# EAGLE design Schematic (EAGLE 8.5.0)
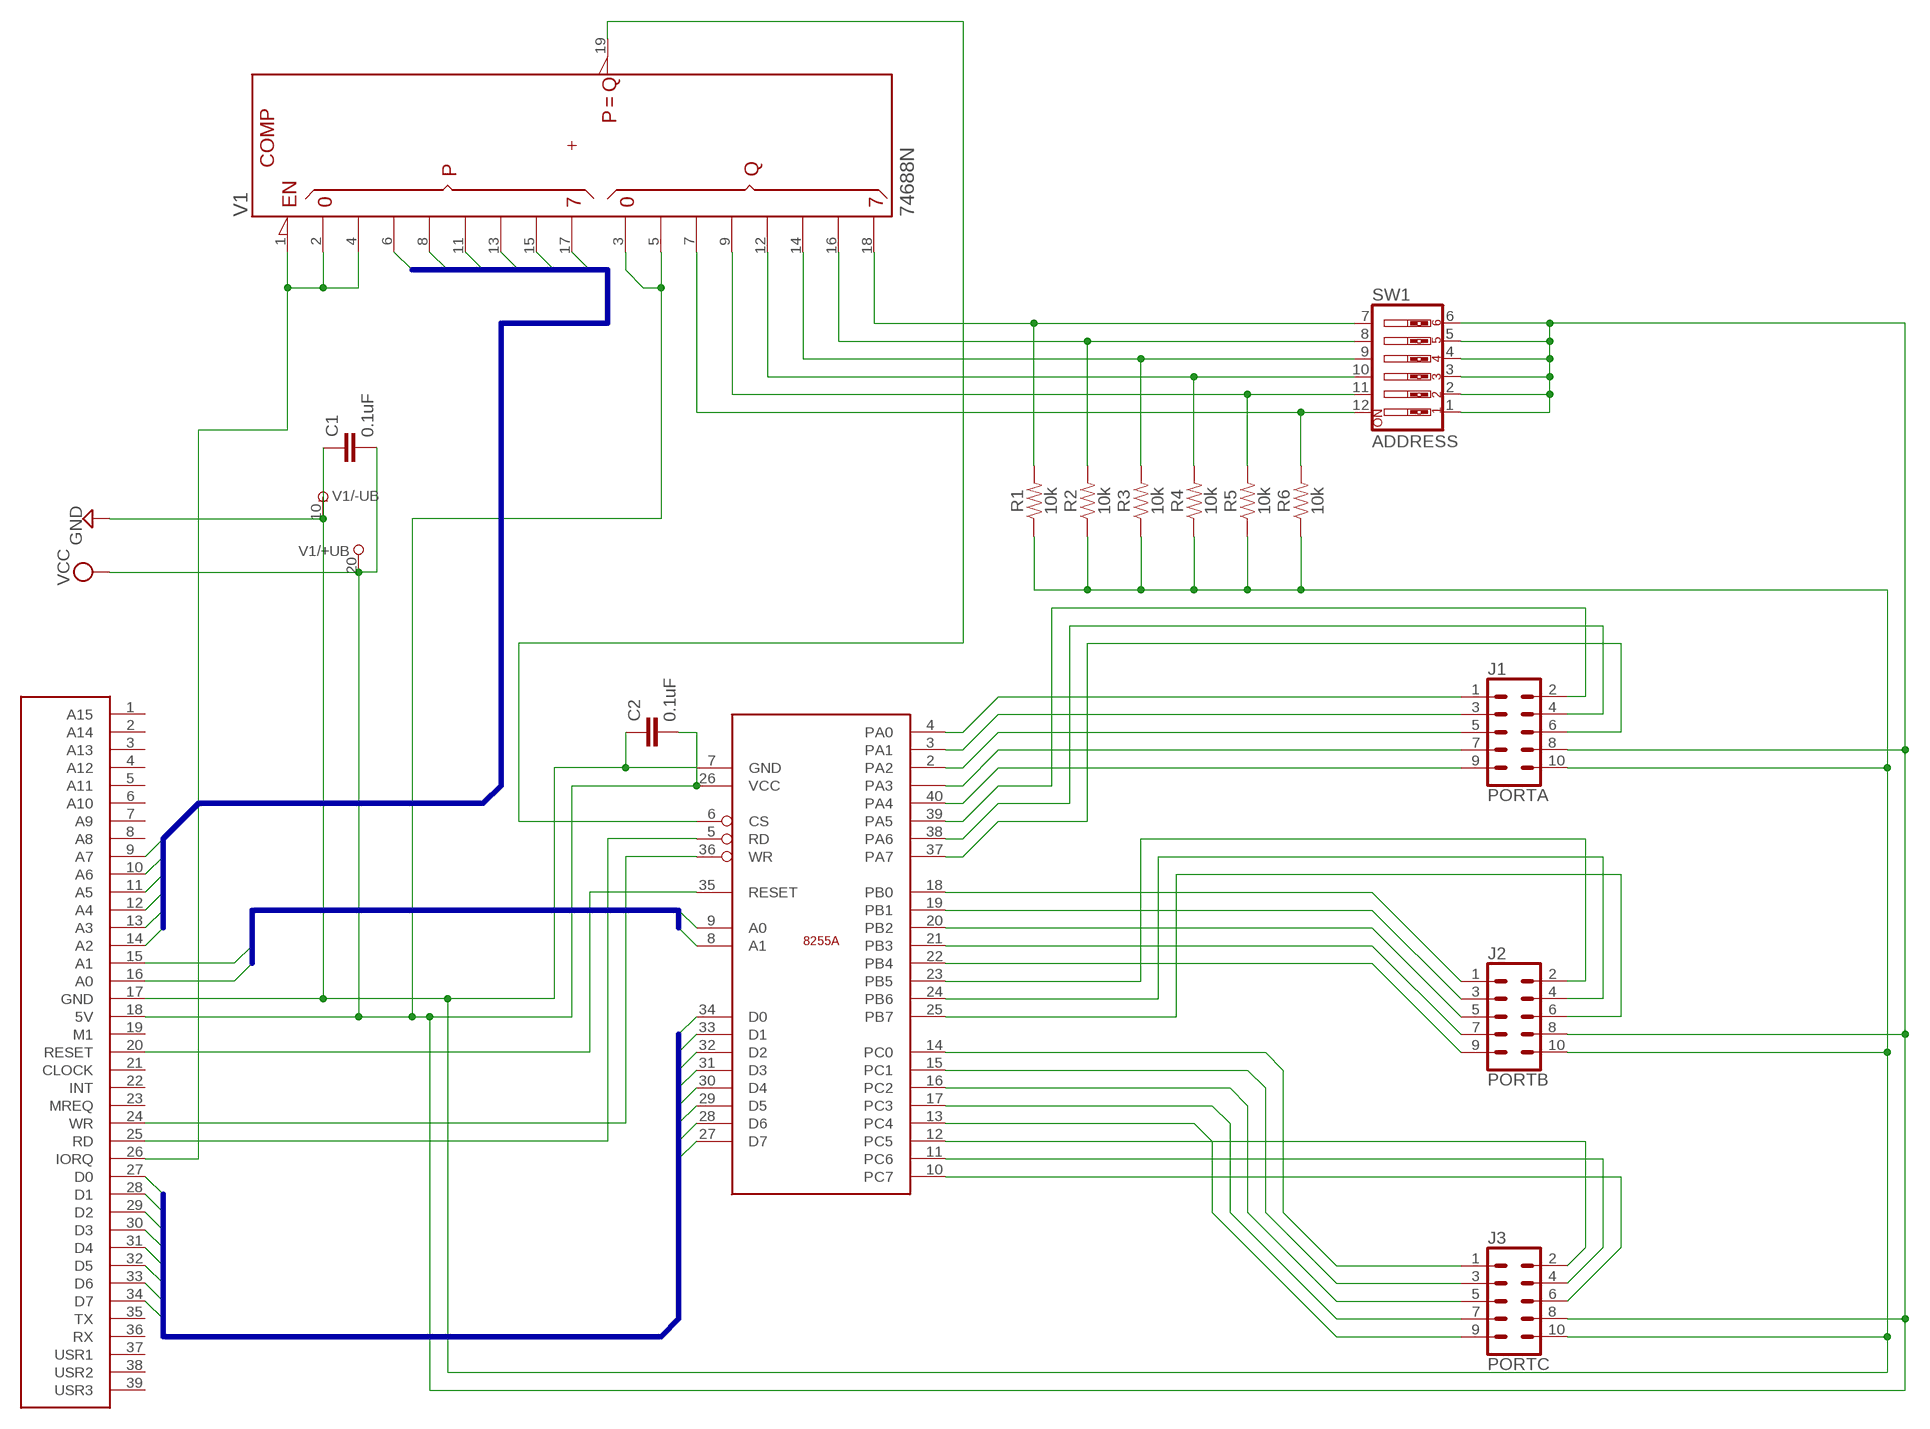
[diagram p0: schematic, sheet 1]

## Parts
C1  0.1uF  0.1UF-KIT-EZ-50V-20%  [CAP-PTH-SMALL-KIT]
C2  0.1uF  0.1UF-KIT-EZ-50V-20%  [CAP-PTH-SMALL-KIT]
J1  PORTA  CONN_05X2SHD  [2X5-SHROUDED]
J2  PORTB  CONN_05X2SHD  [2X5-SHROUDED]
J3  PORTC  CONN_05X2SHD  [2X5-SHROUDED]
R1  10k  10KOHM-HORIZ-1/4W-1%  [AXIAL-0.3]
R2  10k  10KOHM-HORIZ-1/4W-1%  [AXIAL-0.3]
R3  10k  10KOHM-HORIZ-1/4W-1%  [AXIAL-0.3]
R4  10k  10KOHM-HORIZ-1/4W-1%  [AXIAL-0.3]
R5  10k  10KOHM-HORIZ-1/4W-1%  [AXIAL-0.3]
R6  10k  10KOHM-HORIZ-1/4W-1%  [AXIAL-0.3]
SW1  ADDRESS  SW_DIP-6  [EDG-06]
U$1  RC2014BUS  [RC2014BUS]
U$2  8255  [8255]
V1  74688N  [DIL20]

## Nets
ADRBUS0: U$1.14(A2) U$1.15(A1) U$1.16(A0) U$2.9(A0) V1.6(P2)
ADRBUS1: U$1.13(A3) U$2.8(A1) V1.8(P3)
ADRBUS2: U$1.12(A4) V1.11(P4)
ADRBUS3: U$1.11(A5) V1.13(P5)
ADRBUS4: U$1.10(A6) V1.15(P6)
ADRBUS5: U$1.9(A7) V1.17(P7)
DATABUS0: U$1.27(D0) U$2.34(D0)
DATABUS1: U$1.28(D1) U$2.33(D1)
DATABUS2: U$1.29(D2) U$2.32(D2)
DATABUS3: U$1.30(D3) U$2.31(D3)
DATABUS4: U$1.31(D4) U$2.30(D4)
DATABUS5: U$1.32(D5) U$2.29(D5)
DATABUS6: U$1.33(D6) U$2.28(D6)
DATABUS7: U$1.34(D7) U$2.27(D7)
GND: C1.1 C2.1 J1.10 J2.10 J3.10 R1.P$1 R2.P$1 R3.P$1 R4.P$1 R5.P$1 R6.P$1 U$1.17(GND) U$2.7(GND) V1.10(-UB)
N$1: U$1.20(RESET) U$2.35(RESET)
N$4: U$1.25(RD) U$2.5(RD)
N$5: U$1.24(WR) U$2.36(WR)
N$26: U$2.6(CS) V1.19(!P=Q)
N$33: U$1.26(IORQ) V1.1(!G) V1.2(P0) V1.4(P1)
N$34: R1.P$2 SW1.7 V1.18(Q7)
N$35: R2.P$2 SW1.8 V1.16(Q6)
N$36: R3.P$2 SW1.9 V1.14(Q5)
N$37: R4.P$2 SW1.10 V1.12(Q4)
N$38: R5.P$2 SW1.11 V1.9(Q3)
N$39: R6.P$2 SW1.12 V1.7(Q2)
N$40: J2.1 U$2.18(PB0)
N$41: J1.7 U$2.1(PA3)
N$42: J1.9 U$2.40(PA4)
N$43: J1.2 U$2.39(PA5)
N$44: J1.4 U$2.38(PA6)
N$45: J1.6 U$2.37(PA7)
N$46: J1.1 U$2.4(PA0)
N$47: J1.3 U$2.3(PA1)
N$48: J1.5 U$2.2(PA2)
N$49: J2.3 U$2.19(PB1)
N$50: J2.5 U$2.20(PB2)
N$51: J2.7 U$2.21(PB3)
N$52: J2.9 U$2.22(PB4)
N$53: J2.2 U$2.23(PB5)
N$54: J2.4 U$2.24(PB6)
N$55: J2.6 U$2.25(PB7)
N$56: J3.1 U$2.14(PC0)
N$57: J3.3 U$2.15(PC1)
N$58: J3.5 U$2.16(PC2)
N$59: J3.7 U$2.17(PC3)
N$60: J3.9 U$2.13(PC4)
N$61: J3.2 U$2.12(PC5)
N$62: J3.4 U$2.11(PC6)
N$63: J3.6 U$2.10(PC7)
VCC: C1.2 C2.2 J1.8 J2.8 J3.8 SW1.1 SW1.2 SW1.3 SW1.4 SW1.5 SW1.6 U$1.18(5V) U$2.26(VCC) V1.3(Q0) V1.5(Q1) V1.20(+UB)
Unconnected: U$1.1(A15) U$1.2(A14) U$1.3(A13) U$1.4(A12) U$1.5(A11) U$1.6(A10) U$1.7(A9) U$1.8(A8) U$1.19(M1) U$1.21(CLOCK) U$1.22(INT) U$1.23(MREQ) U$1.35(TX) U$1.36(RX) U$1.37(USR1) U$1.38(USR2) U$1.39(USR3)

## Buses
DATABUS[0..7]
ADRBUS[0..1]
ADRBUS[0..5]

## Library data of the parts
C1 C2 = SparkFun-Capacitors:0.1UF: 0.1µF ceramic capacitors A capacitor is a passive two-terminal electrical component used to store electrical energy temporarily in an electric field.; PROD_ID: CAP-08370
J1-J3 = SparkFun-Connectors:CONN_05X2: Multi connection point. Often used as Generic Header-pin footprint for 0.1 inch spaced/style header connections For AVR SPI programming port, see special device with nice symbol: "AVR_SPI_PROG_5x2.dev" You can populate with any combo of single row headers, but if you'd like an exact match, check these: 2x5 AVR ICSP Male Header <https://www.sparkfun.com/products/778> (PRT-00778) 2x5 Pin Shrouded Header <https://www.sparkfun.com/products/8506> (PRT-08506) On any of the 0.1 inch spaced packages, you can populate with these: Break Away Headers - Straight <https://www.sparkfun.com/products/116> (PRT-00116) Break Away Male Headers - Right Angle <https://www.sparkfun.com/products/553> (PRT-00553) Female Headers <https://www.sparkfun.com/products/115> (PRT-00115) Break Away Headers - Machine Pin <https://www.sparkfun.com/products/117> (PRT-00117) Break Away Female Headers - Swiss Machine Pin <https://www.sparkfun.com/products/743> (PRT-00743) Special note: the shrouded connector mates well with our 5x2 ribbon cables: 2x5 Pin IDC Ribbon Cable <https://www.sparkfun.com/products/8535> (PRT-08535); PROD_ID: CONN-08671; SF_ID: PRT-08506
R1-R6 = SparkFun-Resistors:10KOHM: 10kΩ resistor A resistor is a passive two-terminal electrical component that implements electrical resistance as a circuit element. Resistors act to reduce current flow, and, at the same time, act to lower voltage levels within circuits. - Wikipedia; PROD_ID: RES-12183
SW1 = special:SW_DIP-6: DIP SWITCH
U$1 = my_lib:RC2014BUS: RC2014 BUS
U$2 = my_lib:8255: The Intel 8255 (or i8255) Programmable Peripheral Interface (PPI) chip was developed and manufactured by Intel in the first half of the 1970s for the Intel 8080 microprocessor.
V1 = 74ttl-din:74*688: 8-bit MAGNITUDE/IDENTITY COMPARATOR, totem pole

## Board
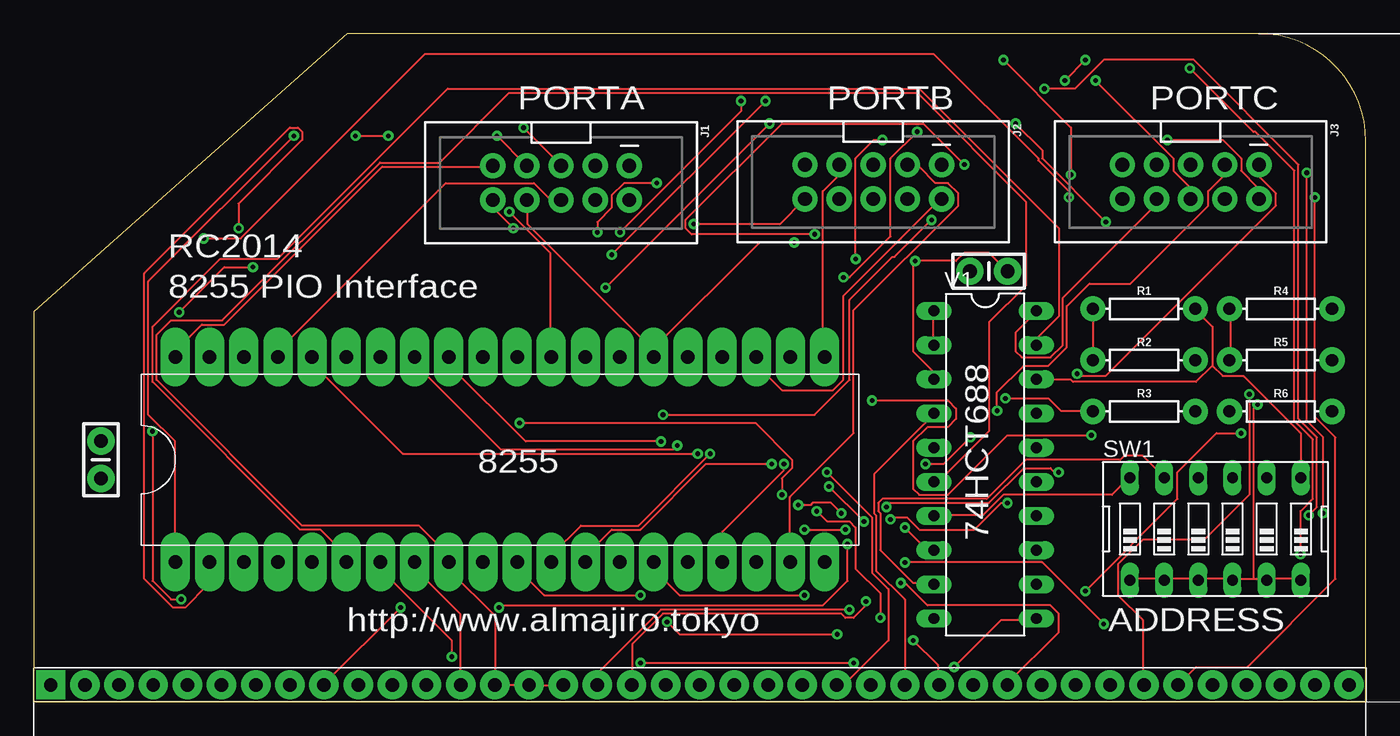
[diagram p1: board, top side]
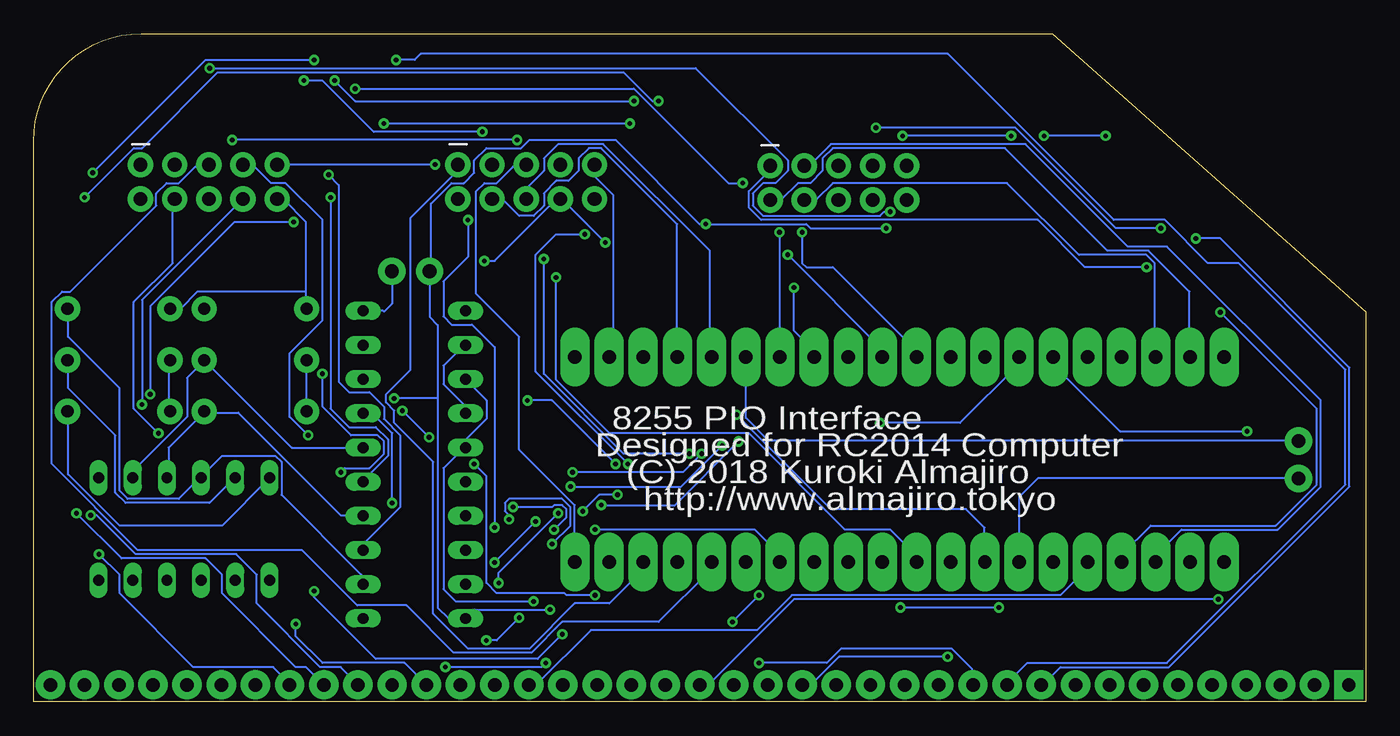
[diagram p2: board, bottom side, seen from below]

Size 99.04 x 49.66 mm. Coordinates in mm from the lower left corner, seen from the top.
Outline: 0,0 99.04,0 99.04,41.67 arc90 91.05,49.66 23.32,49.66 0,29 0,0
Copper layers (1*16): Top 0.035mm / dielectric 1.5mm / Bottom 0.035mm
Design rules "default": minimum track width 6mil, minimum drill 0.35mm, track to track 6mil, track to pad 6mil, pad to pad 6mil, via to via 6mil, smd to smd 6mil, copper to edge 40mil, drill to drill 6mil, minimum pad ring 10mil, minimum via ring 8mil, stop-mask expansion 4mil, vias tented up to drill 0mil, thermal gap 10mil

### Footprints (pad centres in the part's own frame; a part is rotated, then mirrored left to right if it is on the bottom)
CAP-PTH-SMALL-KIT = drill 1.016 pad 2.032: 1 -1.397,0; 2 1.397,0
2X5-SHROUDED = drill 1.016 pad 1.88: 1 -1.27,5.08; 2 1.27,5.08; 3 -1.27,2.54; 4 1.27,2.54; 5 -1.27,0; 6 1.27,0; 7 -1.27,-2.54; 8 1.27,-2.54; 9 -1.27,-5.08; 10 1.27,-5.08
AXIAL-0.3 = drill 0.9 pad 1.88: P$1 -3.81,0; P$2 3.81,0
EDG-06 = drill 0.813 long: 1 -6.35,-3.81; 2 -3.81,-3.81; 3 -1.27,-3.81; 4 1.27,-3.81; 5 3.81,-3.81; 6 6.35,-3.81; 7 6.35,3.81; 8 3.81,3.81; 9 1.27,3.81; 10 -1.27,3.81; 11 -3.81,3.81; 12 -6.35,3.81
RC2014BUS = drill 1 pad 2.184 square: 1 -17.78,22.86 | drill 1 pad 2.184: 2 -17.78,20.32; 3 -17.78,17.78; 4 -17.78,15.24; 5 -17.78,12.7; 6 -17.78,10.16; 7 -17.78,7.62; 8 -17.78,5.08; 9 -17.78,2.54; 10 -17.78,0; 11 -17.78,-2.54; 12 -17.78,-5.08; 13 -17.78,-7.62; 14 -17.78,-10.16; 15 -17.78,-12.7; 16 -17.78,-15.24; 17 -17.78,-17.78; 18 -17.78,-20.32; 19 -17.78,-22.86; 20 -17.78,-25.4; 21 -17.78,-27.94; 22 -17.78,-30.48; 23 -17.78,-33.02; 24 -17.78,-35.56; 25 -17.78,-38.1; 26 -17.78,-40.64; 27 -17.78,-43.18; 28 -17.78,-45.72; 29 -17.78,-48.26; 30 -17.78,-50.8; 31 -17.78,-53.34; 32 -17.78,-55.88; 33 -17.78,-58.42; 34 -17.78,-60.96; 35 -17.78,-63.5; 36 -17.78,-66.04; 37 -17.78,-68.58; 38 -17.78,-71.12; 39 -17.78,-73.66
8255 = drill 1 pad 2.184 long: 1 -7.62,13.97; 2 -7.62,11.43; 3 -7.62,8.89; 4 -7.62,6.35; 5 -7.62,3.81; 6 -7.62,1.27; 7 -7.62,-1.27; 8 -7.62,-3.81; 9 -7.62,-6.35; 10 -7.62,-8.89; 11 -7.62,-11.43; 12 -7.62,-13.97; 13 -7.62,-16.51; 14 -7.62,-19.05; 15 -7.62,-21.59; 16 -7.62,-24.13; 17 -7.62,-26.67; 18 -7.62,-29.21; 19 -7.62,-31.75; 20 -7.62,-34.29; 21 7.62,-34.29; 22 7.62,-31.75; 23 7.62,-29.21; 24 7.62,-26.67; 25 7.62,-24.13; 26 7.62,-21.59; 27 7.62,-19.05; 28 7.62,-16.51; 29 7.62,-13.97; 30 7.62,-11.43; 31 7.62,-8.89; 32 7.62,-6.35; 33 7.62,-3.81; 34 7.62,-1.27; 35 7.62,1.27; 36 7.62,3.81; 37 7.62,6.35; 38 7.62,8.89; 39 7.62,11.43; 40 7.62,13.97
DIL20 = drill 0.813 long: 1 -11.43,-3.81; 2 -8.89,-3.81; 3 -6.35,-3.81; 4 -3.81,-3.81; 5 -1.27,-3.81; 6 1.27,-3.81; 7 3.81,-3.81; 8 6.35,-3.81; 9 8.89,-3.81; 10 11.43,-3.81; 11 11.43,3.81; 12 8.89,3.81; 13 6.35,3.81; 14 3.81,3.81; 15 1.27,3.81; 16 -1.27,3.81; 17 -3.81,3.81; 18 -6.35,3.81; 19 -8.89,3.81; 20 -11.43,3.81

### Placement (x,y rotation side)
C1  71,32 0 top
C2  5,18 90 top
J1  39.21,38.57 270 top
J2  62.42,38.64 270 top
J3  86.01,38.64 270 top
R1  82.55,29.21 0 top
R2  82.55,25.4 0 top
R3  82.55,21.59 0 top
R4  92.71,29.21 0 top
R5  92.71,25.4 0 top
R6  92.71,21.59 0 top
SW1  87.86,12.85 0 top
U$1  24.13,19.05 90 top
U$2  24.51,18.01 90 top
V1  70.74,17.63 270 top

### Tracks (layer width: path | path; a pad name or v marks a point on that pad's centre or on a via)
ADRBUS0
  Top 0.152: U$1.16 39.32,1.22 36.88,1.22 U$1.15 36.73,1.22 34.29,1.22 U$1.14 34.29,6.4 30.94,9.75 30.94,10.36 U$2.9 30.79,10.52 30.79,10.97 28.65,13.11 19.96,13.11 9.14,23.93 9.14,27.28 10.21,28.35 14.02,28.35 25.76,40.08 30.18,40.08 35.36,45.26 65.68,45.26 73.76,37.19 73.76,30.94 71.02,28.19 71.02,20.12 67.36,16.46 67.06,16.46 V1.6
ADRBUS1  (via drill 0.35)
  Top 0.152: V1.8 66.45,11.28 v64.77,12.95 | v66.75,35.81 64.01,33.07 63.86,33.07 60.66,29.87 60.66,23.93 58.06,21.34 v46.79,21.34 | U$1.13 31.7,1.37 31.7,6.55 28.35,9.91 28.35,10.36 U$2.8
  Bottom 0.152: v64.77,12.95 64.77,26.36 66.45,28.04 67.97,28.04 68.58,28.65 68.58,31.24 66.75,33.07 v66.75,35.81 | v46.79,21.34 39.78,14.33 29.72,14.33 28.35,12.95 28.35,10.52 U$2.8
ADRBUS2  (via drill 0.35)
  Top 0.152: v68.43,2.59 71.93,6.1 74.52,6.1 V1.11 | v45.11,2.9 v60.96,2.9
  Bottom 0.152: v68.43,2.59 61.27,2.59 v60.96,2.9 | v45.11,2.9 40.08,2.9 39.01,3.96 30.79,3.96 29.26,2.44 29.26,1.37 U$1.12
ADRBUS3  (via drill 0.35)
  Top 0.152: v77.11,39.17 77.11,42.67 v72.08,47.7
  Bottom 0.152: v77.11,39.17 76.35,38.41 76.35,23.77 75.59,23.01 74.07,23.01 73,21.95 73,21.03 71.78,19.81 71.78,14.48 74.52,11.73 74.52,11.28 V1.13 | v72.08,47.7 70.71,47.7 70.26,48.16 31.09,48.16 18.75,35.81 14.94,35.81 11.73,32.61 9.45,32.61 1.52,24.69 1.52,16.15 14.78,2.9 25.15,2.9 26.67,1.37 U$1.11
ADRBUS4  (via drill 0.35)
  Top 0.152: v76.96,37.49 76.96,37.95 74.68,40.23 74.68,40.39 66.9,48.16 29.11,48.16 15.39,34.44 v12.65,34.44
  Bottom 0.152: v76.96,37.49 76.96,21.79 75.59,20.42 73.61,20.42 72.69,19.51 72.69,18.29 74.52,16.46 V1.15 | v12.65,34.44 10.82,34.44 1.22,24.84 1.22,16 14.63,2.59 22.71,2.59 24.08,1.22 U$1.10
ADRBUS5  (via drill 0.35)
  Top 0.152: v72.39,14.78 71.93,14.78 69.95,12.8 65.84,12.8 64.92,13.72 63.86,13.72 v63.7,13.56 | v60.5,11.73 60.5,8.99 58.67,7.16 34.75,7.16 v34.59,7.01 | v27.28,7.01 21.64,1.37 U$1.9
  Bottom 0.152: v72.39,14.78 72.39,19.96 73.76,21.34 74.52,21.34 V1.17 | v63.7,13.56 63.7,13.87 64.01,14.17 64.01,14.78 63.7,15.09 59.74,15.09 59.13,14.48 59.13,13.11 v60.5,11.73 | v27.28,7.01 v34.59,7.01
DATABUS0  (via drill 0.35)
  Top 0.152: v65.38,4.57 67.21,2.74 67.21,1.37 U$1.27 | v62.94,6.25 62.94,8.08 61.11,9.91 61.11,12.95 60.66,13.41 58.98,13.41 v58.22,14.17 | v55.63,15.39 55.63,16.61 56.39,17.37 56.39,17.98 53.65,20.73 v36.12,20.73
  Bottom 0.152: v65.38,4.57 64.62,4.57 v62.94,6.25 | v58.22,14.17 57,15.39 v55.63,15.39 | v36.12,20.73 30.18,20.73 25.91,24.99 25.91,25.6 U$2.34
DATABUS1  (via drill 0.35)
  Top 0.152: v47.85,19.05 47.55,18.75 34.75,18.75 28.35,25.15 28.35,25.6 U$2.33 | v61.72,13.41 v59.13,16 | v64.77,10.36 74.98,10.36 v79.55,5.79
  Bottom 0.152: v47.85,19.05 50.9,16 v59.13,16 | v64.77,10.36 v61.72,13.41 | v79.55,5.79 79.55,4.88 77.57,2.9 71.48,2.9 U$1.28
DATABUS2  (via drill 0.35)
  Top 0.152: v46.63,19.36 36.58,19.36 30.94,24.99 30.94,25.6 U$2.32 | v56.84,14.63 57.76,14.63 57.91,14.78 59.28,14.78 v60.05,14.02 | v64.47,8.84 64.77,8.84 66.45,7.16 75.59,7.16 76.2,6.55 76.2,5.18 72.39,1.37 U$1.29
  Bottom 0.152: v46.63,19.36 51.36,14.63 v56.84,14.63 | v60.05,14.02 64.47,9.6 v64.47,8.84
DATABUS3  (via drill 0.35)
  Top 0.152: v41.91,34.9 41.91,35.66 42.98,36.73 42.98,37.64 43.89,38.56 v46.33,38.56 | v75.13,45.57 77.42,45.57 79.55,47.7 86.26,47.7 94.03,39.93 94.03,21.03 95.4,19.66 95.4,14.48 v94.79,13.87
  Bottom 0.152: v41.91,34.9 41.91,32.61 41.6,32.31 39.62,32.31 33.53,26.21 33.53,25.76 U$2.31 | v46.33,38.56 47.4,38.56 54.41,45.57 v75.13,45.57 | v94.79,13.87 94.34,13.87 91.44,10.97 83.97,10.97 82.45,9.45 82.45,7.32 77.72,2.59 76.2,2.59 74.98,1.37 U$1.30
DATABUS4  (via drill 0.35)
  Top 0.152: v54.41,44.65 v42.98,33.22 | v78.18,47.7 v76.66,46.18 | v94.64,39.32 94.64,20.88 95.86,19.66 v95.86,14.02
  Bottom 0.152: v42.98,33.22 35.97,26.21 35.97,25.76 U$2.30 | v54.41,44.65 75.13,44.65 v76.66,46.18 | v78.18,47.7 86.26,47.7 v94.64,39.32 | v95.86,14.02 92.51,10.67 86.26,10.67 85.04,9.45 85.04,8.08 79.55,2.59 78.79,2.59 U$1.31
DATABUS5  (via drill 0.35)
  Top 0.152: v35.36,36.42 38.41,33.38 38.41,25.76 U$2.29 | v85.95,47.09 90.68,42.37 90.83,42.37 93.73,39.47 93.73,20.88 95.1,19.51 95.1,15.09 94.18,14.17 v94.18,10.97
  Bottom 0.152: v35.36,36.42 35.81,36.42 36.12,36.12 44.81,36.12 45.57,36.88 45.57,37.8 44.81,38.56 43.89,38.56 42.98,39.47 42.98,40.23 49.84,47.09 v85.95,47.09 | v94.18,10.97 92.66,9.45 92.66,8.08 87.17,2.59 81.23,2.59 80.01,1.37 U$1.32
DATABUS6  (via drill 0.35)
  Top 0.152: v90.37,22.86 90.37,15.39 87.02,12.04 82.45,12.04 80.62,10.21 80.62,7.92 82.45,6.1 82.45,1.37 U$1.33 | v79.7,35.66 74.98,40.39 74.98,41 v73,42.98 | v42.52,30.79 v54.71,42.98
  Bottom 0.152: v90.37,22.86 90.37,29.41 84.12,35.66 v79.7,35.66 | v54.71,42.98 v73,42.98 | v42.52,30.79 42.52,27.58 41.15,26.21 41.15,25.76 U$2.28
DATABUS7  (via drill 0.35)
  Top 0.152: v43.59,34.9 52.58,43.89 v52.58,44.65 | v95.25,37.49 95.25,21.18 96.77,19.66 96.77,9.14 90.22,2.59 86.41,2.59 U$1.34
  Bottom 0.152: v43.59,34.9 43.59,25.76 U$2.27 | v52.58,44.65 53.03,44.65 55.17,46.79 85.34,46.79 90.98,41.15 91.59,41.15 v95.25,37.49
GND  (via drill 0.35)
  Top 0.152: R4.P$1 89,29.11 89,25.45 R5.P$1 | R1.P$1 78.79,29.11 78.79,25.45 R2.P$1 | v35.66,35.2 34.14,36.73 34.14,37.19 J1.10 | v49.07,35.51 55.47,35.51 57.3,37.34 J2.10 | v31.09,3.35 31.09,4.57 25.91,9.75 25.91,10.36 U$2.7 | U$1.17 41.91,2.13 46.63,6.86 v60.66,6.86 | v72.24,22.55 75.44,22.55 76.35,21.64 78.64,21.64 R3.P$1
  Bottom 0.152: C2.1 24.4,16.6 25.78,15.22 U$2.7 | 69,22.55 69,28 69.6,28.6 C1.1 69.49,32 69.49,37.03 67.97,38.56 67.06,38.56 66.29,39.32 66.29,40.23 65.38,41.15 62.79,41.15 62.18,41.76 55.78,41.76 49.53,35.51 v49.07,35.51 41.6,35.51 41.3,35.2 v35.66,35.2 | 69,22.55 69,7 68.2,6.2 V1.10 66.9,6.25 66.29,6.86 v60.66,6.86 | R6.P$1 89,21.64 89,25.3 R5.P$1 | R3.P$1 78.79,21.64 78.79,25.3 R2.P$1 | 78.79,30.48 78.79,29.26 R1.P$1 | 78.79,30.48 78.79,35.66 80.47,37.34 80.92,37.34 J3.10 | 78.79,30.48 86.87,30.48 88.09,29.26 88.85,29.26 R4.P$1 | v31.09,3.35 39.17,3.35 41.15,1.37 41.91,1.37 U$1.17 | 69,22.55 v72.24,22.55
N$1  (via drill 0.35)
  Top 0.152: v10.97,7.62 10.21,7.62 8.84,8.99 v8.84,20.12
  Bottom 0.152: v10.97,7.62 42.52,7.62 48.77,1.37 49.53,1.37 U$1.20 | v8.84,20.12 18.29,20.12 23.16,24.99 23.16,25.6 U$2.35
N$4
  Bottom 0.152: U$1.25 62.18,1.37 61.57,1.37 57.61,5.33 45.26,5.33 42.67,7.92 22.71,7.92 20.73,9.91 20.73,10.36 U$2.5
N$5  (via drill 0.35)
  Top 0.152: v58.98,17.07 62.33,13.72 62.33,9.6 63.55,8.38 63.55,4.57 60.35,1.37 59.74,1.37 U$1.24 | v49.38,18.44 27.43,18.44 20.73,25.15 20.73,25.6 U$2.36
  Bottom 0.152: v58.98,17.07 50.75,17.07 v49.38,18.44
N$26
  Top 0.152: V1.19 74.68,26.52 74.68,27.13 76.2,28.65 76.2,35.2 65.84,45.57 30.79,45.57 18.14,32.92 13.87,32.92 8.84,27.89 8.84,23.77 19.81,12.8 21.34,12.8 23.16,10.97 23.16,10.52 U$2.6
N$33
  Top 0.152: V1.1 66.9,28.96 66.9,26.52 V1.2 | U$1.26 64.77,7.62 62.64,9.75 62.64,13.87 62.48,14.02 62.48,16.92 66.9,21.34 V1.4
  Bottom 0.152: V1.4 67.06,21.49 67.06,22.1 68.58,23.62 68.58,24.99 67.06,26.52 V1.2
N$34
  Top 0.152: 87.63,24.99 88.39,24.23 89.92,24.23 94.18,19.96 94.18,16.76 SW1.7 | 87.63,24.99 87.63,27.89 86.41,29.11 R1.P$2 | 87.63,24.99 86.41,23.77 77.27,23.77 77.11,23.93 74.68,23.93 V1.18
N$35
  Bottom 0.152: SW1.8 91.59,16.76 91.59,17.22 87.63,21.18 87.63,24.08 86.41,25.3 R2.P$2 79.86,18.9 V1.16
N$36
  Bottom 0.152: V1.14 74.68,13.87 76.2,13.87 83.82,21.49 86.26,21.49 R3.P$2 86.41,21.49 89,18.9 89,16.76 SW1.9
N$37
  Bottom 0.152: V1.12 74.68,8.84 74.68,9.45 80.62,15.39 80.62,17.83 81.08,18.29 85.04,18.29 86.56,16.76 SW1.10 86.72,16.61 88.24,15.09 92.05,15.09 92.66,15.7 92.66,23.32 96.47,27.13 96.47,29.11 R4.P$2
N$38
  Top 0.152: V1.9 66.9,8.84 65.38,8.84 62.94,11.28 62.94,14.02 62.79,14.17 62.79,14.78 63.09,15.09 70.87,15.09 73.76,17.98 80.77,17.98 81.08,18.29 82.45,18.29 83.97,16.76 SW1.11
  Bottom 0.152: R5.P$2 96.47,25.3 96.47,23.32 92.96,19.81 92.96,15.54 92.2,14.78 85.95,14.78 84.12,16.61 SW1.11
N$39
  Top 0.152: V1.7 67.06,13.87 70.56,13.87 72.08,15.39 80.16,15.39 81.38,16.61 SW1.12
  Bottom 0.152: R6.P$2 96.47,21.49 96.47,16.92 92.66,13.11 85.04,13.11 81.53,16.61 SW1.12
N$40
  Bottom 0.152: J2.1 67.51,39.78 67.51,39.47 71.02,35.97 71.02,24.69 72.85,22.86 72.85,22.25 72.24,21.64 72.24,20.73 69.34,17.83 69.34,6.55 66.75,3.96 62.18,3.96 58.83,7.32 56.24,7.32 53.8,9.75 53.8,10.36 U$2.18
N$41  (via drill 0.35)
  Top 0.152: v34.44,42.06 36.58,39.93 J1.7 | v23.93,42.06 v26.36,42.06 | v19.36,42.06 8.53,31.24 8.53,21.34 10.52,19.36 10.52,10.52 U$2.1
  Bottom 0.152: v26.36,42.06 v34.44,42.06 | v19.36,42.06 v23.93,42.06
N$42
  Top 0.152: J1.9 33.98,39.78 25.91,39.78 14.17,28.04 12.5,28.04 10.67,26.21 10.67,25.76 U$2.40
N$43
  Bottom 0.152: J1.2 44.2,37.34 43.43,37.34 42.22,38.56 41.3,38.56 40.39,39.47 40.39,40.39 39.62,41.15 26.82,41.15 19.2,33.53 16.15,33.53 13.11,30.48 13.11,25.76 U$2.39
N$44
  Bottom 0.152: J1.4 41.6,37.34 40.84,37.34 39.62,38.56 26.67,38.56 21.34,33.22 16.31,33.22 15.7,32.61 15.7,25.76 U$2.38
N$45
  Top 0.152: J1.6 39.17,37.34 38.41,37.34 37.19,38.56 30.63,38.56 18.29,26.21 18.29,25.76 U$2.37
N$46  (via drill 0.35)
  Top 0.152: v16.31,32.31 14.17,32.31 v10.82,28.96
  Bottom 0.152: v16.31,32.31 20.88,32.31 24.38,35.81 44.96,35.81 45.87,36.73 45.87,37.95 44.35,39.47 44.35,39.78 J1.1 | v10.82,28.96 3.66,21.79 3.66,16.15 6.71,13.11 16,13.11 18.14,10.97 18.14,10.52 U$2.4
N$47
  Bottom 0.152: J1.3 41.6,39.93 41.3,39.93 39.78,41.45 25.3,41.45 17.68,33.83 14.78,33.83 3.35,22.4 3.35,16 6.55,12.8 13.72,12.8 15.54,10.97 15.54,10.52 U$2.3
N$48  (via drill 0.35)
  Top 0.152: v36.42,42.67 39.17,39.93 J1.5 | v15.24,35.2 15.24,37.03 19.96,41.76 19.96,42.37 19.66,42.67 19.05,42.67 8.23,31.85 8.23,9.14 10.36,7.01 11.28,7.01 12.95,8.69 12.95,10.36 U$2.2
  Bottom 0.152: v36.42,42.67 26.06,42.67 18.59,35.2 v15.24,35.2
N$49
  Top 0.152: J2.3 65.08,39.78 65.84,39.78 67.06,38.56 67.97,38.56 68.73,37.8 68.73,36.88 60.96,29.11 60.96,19.96 56.24,15.24 56.24,10.52 U$2.19
N$50
  Bottom 0.152: J2.5 62.48,39.78 63.4,39.78 64.62,38.56 65.53,38.56 66.14,37.95 66.14,30.33 62.94,27.13 62.94,18.75 58.83,14.63 58.83,10.52 U$2.20
N$51
  Top 0.152: J2.7 59.74,39.78 59.74,39.01 58.67,37.95 58.67,25.76 U$2.21
N$52
  Bottom 0.152: J2.9 57.3,39.78 57.3,39.01 55.93,37.64 55.93,26.06 56.24,25.76 U$2.22
N$53
  Top 0.152: J2.2 67.36,37.34 60.2,30.18 60.2,23.93 59.44,23.16 55.63,23.16 53.8,24.99 53.8,25.6 U$2.23
N$54
  Bottom 0.152: J2.4 64.92,37.34 64.16,37.34 62.94,36.12 61.87,36.12 61.11,36.88 61.11,37.8 60.2,38.71 59.28,38.71 58.52,39.47 58.52,40.39 57.76,41.15 56.84,41.15 51.21,35.51 51.21,25.76 U$2.24
N$55
  Bottom 0.152: J2.6 62.33,37.49 62.33,38.25 61.11,39.47 61.11,40.39 60.05,41.45 56.69,41.45 48.77,33.53 48.77,25.76 U$2.25
N$56  (via drill 0.35)
  Top 0.152: v77.57,24.38 77.72,24.23 79.7,24.23 92.35,36.88 92.35,37.8 91.14,39.01 91.14,39.78 J3.1 | v76.2,17.07 75.89,17.07 75.59,17.37 73.61,17.37 71.02,14.78 63.7,14.78 v63.4,14.48 | v57.3,12.8 v60.35,12.8
  Bottom 0.152: v77.57,24.38 77.57,21.95 75.44,19.81 73.46,19.81 73,19.36 73,18.44 74.07,17.37 75.89,17.37 v76.2,17.07 | v63.4,14.48 60.5,14.48 60.35,14.63 59.74,14.63 59.44,14.33 59.44,13.72 v60.35,12.8 | v57.3,12.8 45.41,12.8 43.59,10.97 43.59,10.52 U$2.14
N$57  (via drill 0.35)
  Top 0.152: v71.63,21.64 71.63,23.01 73.61,24.99 75.44,24.99 76.81,26.36 76.81,29.41 78.49,31.09 81.53,31.09 87.33,36.88 87.33,37.95 88.54,39.17 88.54,39.78 J3.3 | v69.65,19.66 67.67,17.68 v66.29,17.68 | v57.3,7.92 48.01,7.92 46.18,9.75 46.18,10.36 U$2.15
  Bottom 0.152: v69.65,19.66 v71.63,21.64 | v66.29,17.68 65.38,16.76 65.38,8.84 64.62,8.08 59.59,8.08 59.44,7.92 v57.3,7.92
N$58
  Bottom 0.152: J3.5 86.11,39.78 87.02,39.78 88.24,38.56 89.15,38.56 89.92,37.8 89.92,36.88 96.32,30.48 96.93,30.48 97.69,29.72 97.69,17.68 91.29,11.28 79.1,11.28 74.98,7.16 71.32,7.16 67.82,3.66 62.03,3.66 59.74,5.94 52.58,5.94 48.77,9.75 48.77,10.36 U$2.16
N$59  (via drill 0.35)
  Top 0.152: v78.64,19.81 72.39,19.81 67.97,15.39 65.84,15.39 65.38,15.85 65.38,19.36 66.45,20.42 67.97,20.42 68.58,21.03 68.58,21.79 67.97,22.4 v62.33,22.4 | v55.78,17.68 55.78,17.22 51.21,12.65 51.21,10.52 U$2.17
  Bottom 0.152: v78.64,19.81 80.01,21.18 80.01,25.91 77.57,28.35 77.57,35.81 80.31,38.56 81.38,38.56 82.6,39.78 83.36,39.78 J3.7 | v62.33,22.4 60.5,22.4 v55.78,17.68
N$60  (via drill 0.35)
  Top 0.152: v69.19,39.93 66.14,42.98 55.63,42.98 48.46,35.81 48.46,35.2 48.92,34.75 v58.06,34.75 | v54.86,17.68 49.99,17.68 45.11,12.8 42.98,12.8 41.15,10.97 41.15,10.52 U$2.13
  Bottom 0.152: v69.19,39.93 80.92,39.93 J3.9 | v58.06,34.75 60.2,34.75 61.72,33.22 61.72,24.54 v54.86,17.68
N$61  (via drill 0.35)
  Top 0.152: v84.28,41.76 88.39,41.76 89.76,40.39 89.76,39.47 90.98,38.25 90.98,37.49 J3.2 | v63.09,41.76 62.48,41.76 61.11,40.39 v61.11,32.92 | v50.29,18.44 44.96,13.11 40.69,13.11 38.56,10.97 38.56,10.52 U$2.12
  Bottom 0.152: v63.09,41.76 v84.28,41.76 | v61.11,32.92 61.11,24.38 55.17,18.44 v50.29,18.44
N$62  (via drill 0.35)
  Top 0.152: v89.76,19.96 87.94,19.96 85.04,17.07 85.04,15.09 v78.18,8.23 | v59.74,5.03 48.01,5.03 v47.09,5.94 | v45.11,7.92 37.95,7.92 35.97,9.91 35.97,10.36 U$2.11
  Bottom 0.152: v89.76,19.96 91.59,21.79 91.59,29.72 88.7,32.61 88.7,37.34 J3.4 | v78.18,8.23 78.18,7.77 73.61,3.2 61.57,3.2 v59.74,5.03 | v45.11,7.92 v47.09,5.94
N$63  (via drill 0.35)
  Top 0.152: v78.94,46.18 84.73,40.39 84.73,39.47 85.95,38.25 85.95,37.49 J3.6 | v65.68,42.37 63.7,40.39 63.7,34.59 60.66,31.55 v60.2,31.55
  Bottom 0.152: v78.94,46.18 77.57,46.18 73.76,42.37 v65.68,42.37 | v60.2,31.55 60.2,23.93 56.24,19.96 45.87,19.96 38.71,12.8 35.36,12.8 33.53,10.97 33.53,10.52 U$2.10
VCC  (via drill 0.35)
  Top 0.152: 46.02,26.21 36.73,35.51 36.73,37.19 J1.8 | 46.02,26.21 46.02,25.76 U$2.26 46.02,26.21 | SW1.6 94.18,9.14 91.75,9.14 SW1.5 91.59,9.14 90.68,9.14 | SW1.1 81.53,9.14 83.97,9.14 SW1.2 84.12,9.14 86.56,9.14 SW1.3 86.72,9.14 89,9.14 SW1.4 89.15,9.14 90.68,9.14 | C1.2 71.02,33.38 69.19,33.38 68.58,32.77 v65.53,32.77 65.38,32.61 65.38,26.06 66.9,24.54 66.9,24.08 V1.3 | J3.8 83.36,37.34 83.36,36.88 76.5,30.02 76.5,26.52 75.59,25.6 73.46,25.6 73,26.06 73,27.43 74.52,28.96 V1.20 | v61.87,7.47 61.87,7.16 60.96,6.25 60.35,6.25 60.05,6.55 46.79,6.55 44.5,4.27 44.5,1.37 U$1.18 | 90.68,9.14 90.68,21.79 v90.98,22.1 | 46.02,26.21 53.95,34.14 v56.54,34.14
  Bottom 0.152: C2.2 44.4,19.4 46.1,21.1 U$2.26 | C1.2 72.4,29.6 73,29 73.06,29.06 V1.20 | V1.3 66.9,23.93 65.38,22.4 65.38,21.03 66.9,19.51 66.9,18.9 V1.5 67.06,18.9 68.58,17.37 68.58,8.38 67.67,7.47 v61.87,7.47 | v65.53,32.77 64.77,32.77 60.2,37.34 59.89,37.34 J2.8 59.74,37.34 v56.54,34.14 | v90.98,22.1 90.98,29.87 83.52,37.34 J3.8

### Text on the board
tPlace: PORTA | PORTB | PORTC
tNames: RC2014 | 8255 PIO Interface | 8255 | 74HCT688 | http://www.almajiro.tokyo | ADDRESS
bNames: 8255 PIO Interface | Designed for RC2014 Computer | (C) 2018 Kuroki Almajiro | http://www.almajiro.tokyo